# Altium project Peggy Receiver.PrjPcb
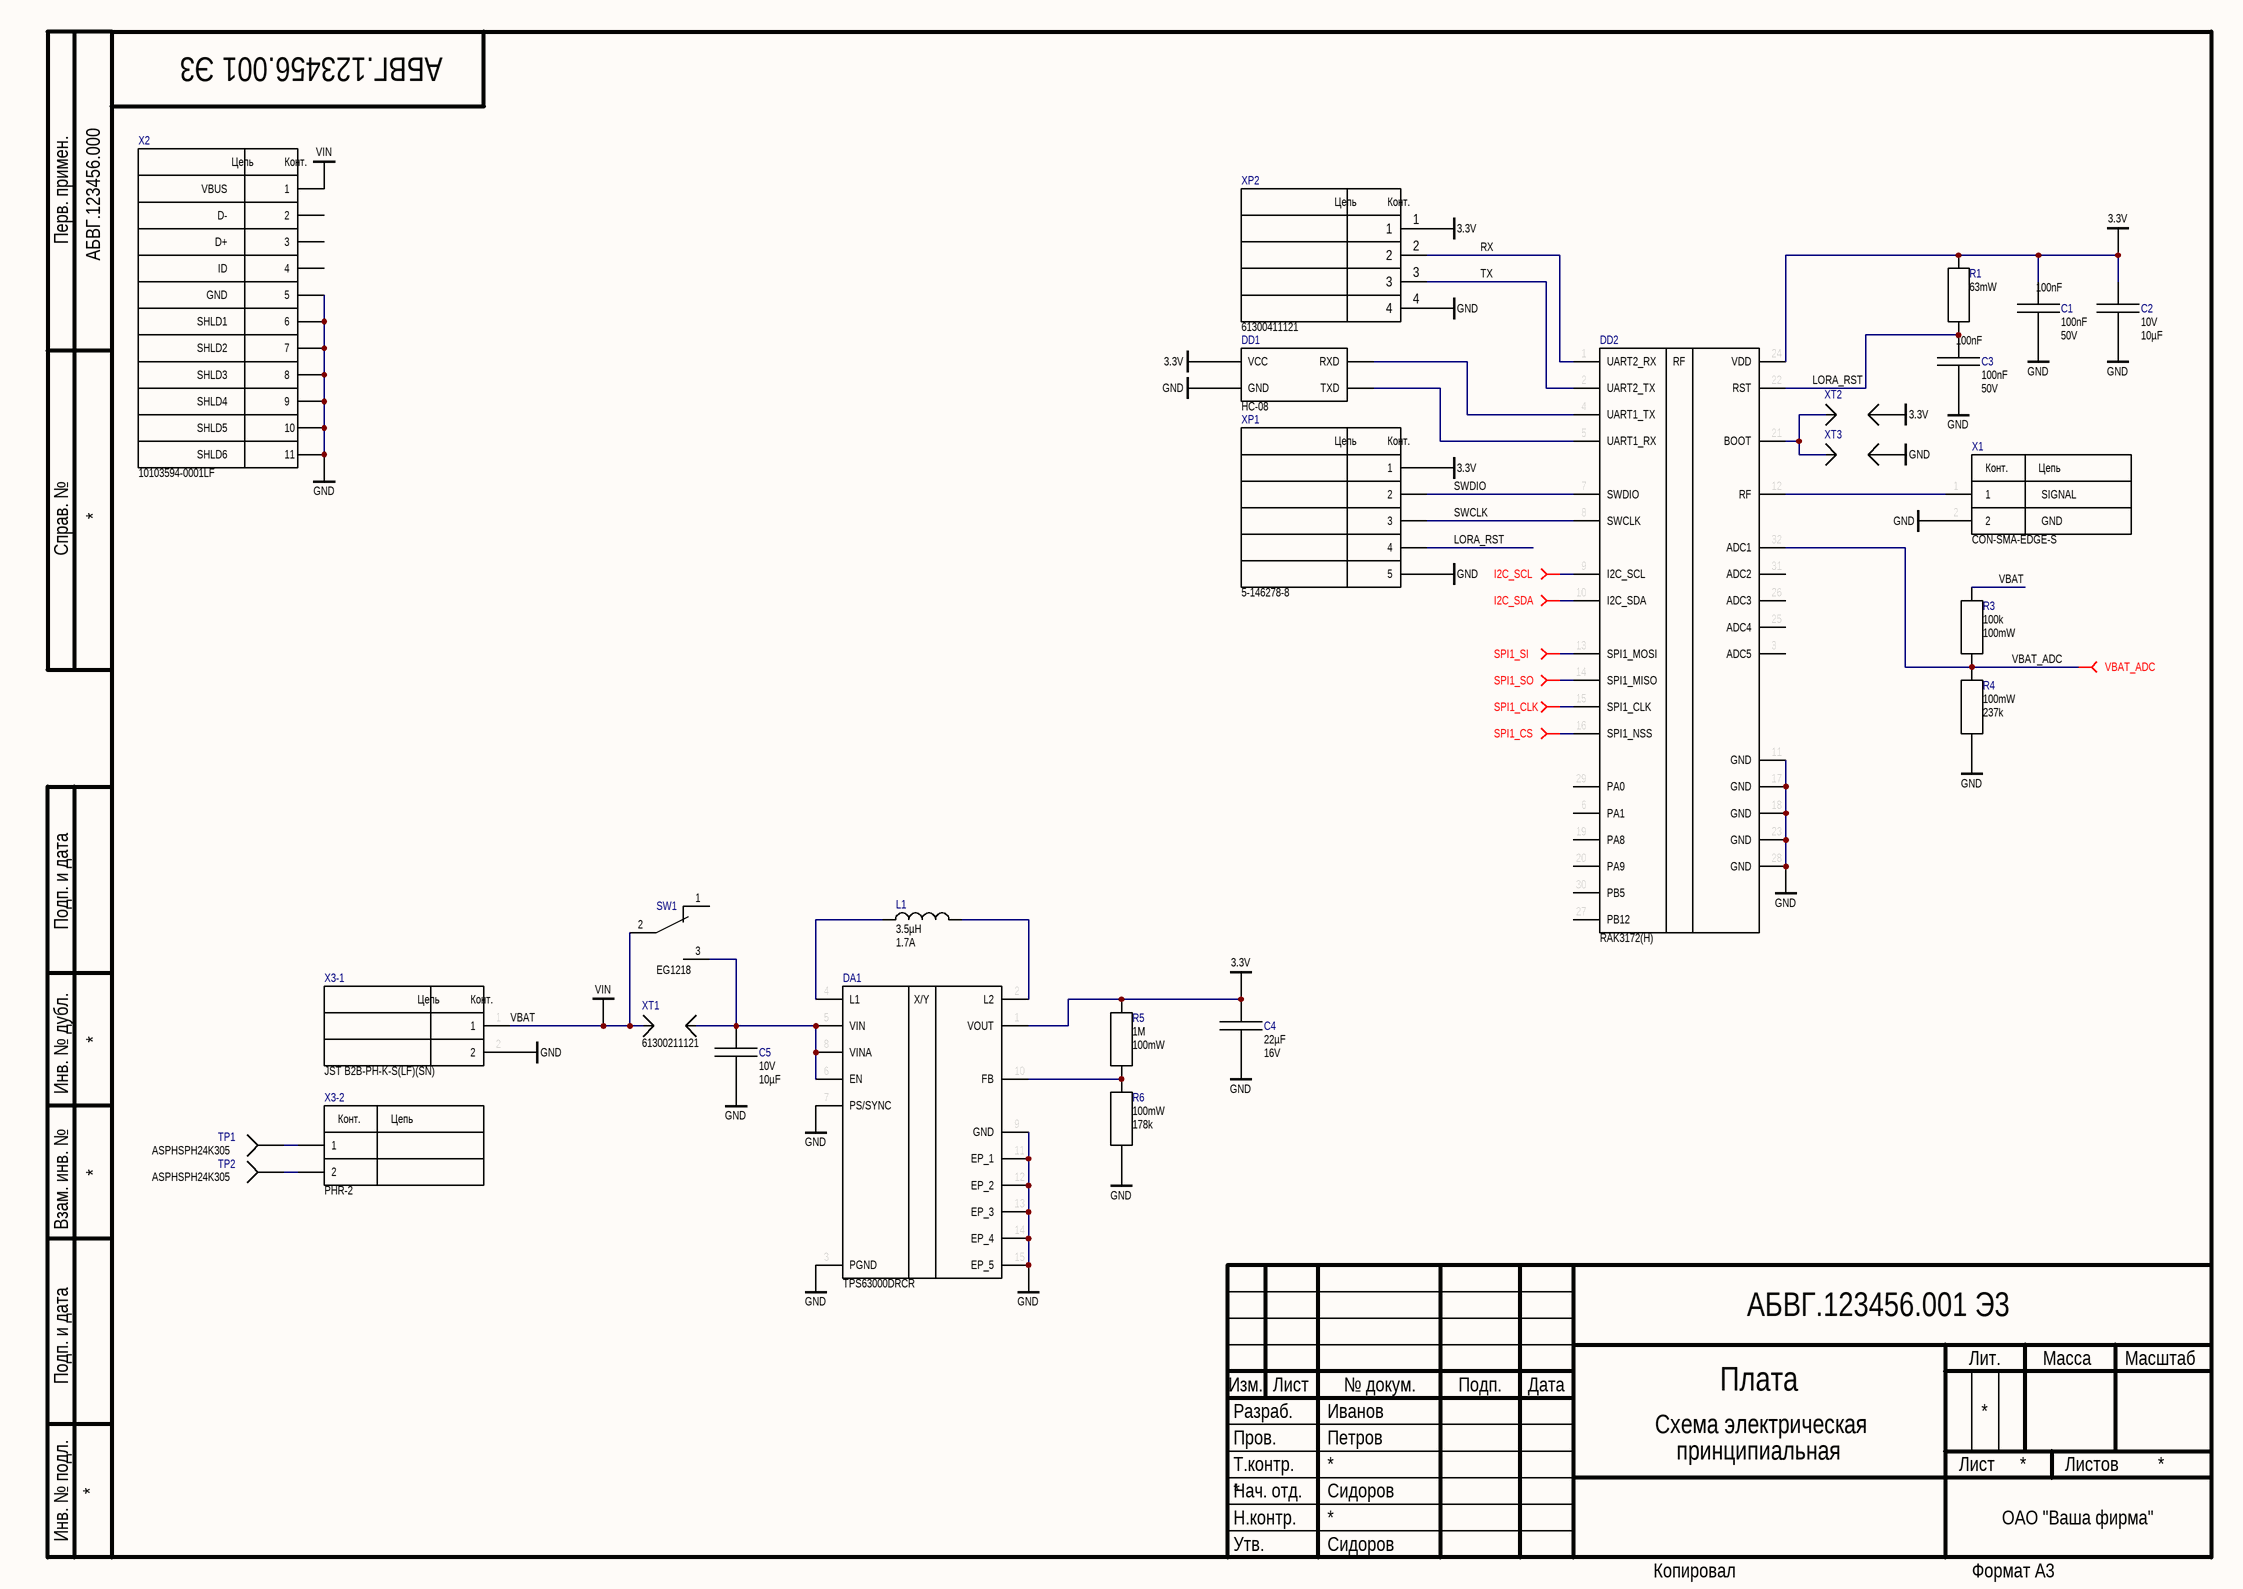
[diagram p0: Принципиальная схема Peggy Receiver.SchDoc]
CAGE_CODE: ?????; CONTRACT_NUMBER: <CONTRACT NO>; DOC_NO_ASSY_DWG: <ASSY DWG NO>; DOC_NO_BOM: <BOM DOC NO>; DOC_NO_FAB_DWG: <FAB DWG NO>; DOC_NO_SCH_DWG: <SCH DWG NO>; PCB_2_DEC_TOL: +/-.01; PCB_3_DEC_TOL: +/-.010; PCB_ANG_TOL: +/-1/2; PCB_ASSEMBLY_NO: <PCB ASSY NO>; PCB_CHECKER: - -----; PCB_CHECKER_APP_DATE: --/--/----; PCB_DESIGNER: - -----; PCB_DESIGNER_APP_DATE: --/--/----; PCB_DWG_NO: <PCB DWG NO>; PCB_ENGINEER: - -----; PCB_ENGINEER_APP_DATE: --/--/----; PCB_PART_NUMBER: <PCB PN>; PCB_REV: A; SCH_REV: A
1 sheet, 33 parts. Net scope: global (net labels, ports and power ports of the same name join across sheets).
Board file: Peggy Receiver.PcbDoc

## Sheet Принципиальная схема Peggy Receiver.SchDoc
size 420 x 297 mm; ENG_APP_DATE: --/--/--; DSN_APP_DATE: --/--/--; CHK_APP_DATE: --/--/--; Scale: 1:1; Разраб.: Иванов; Обозначение документа: АБВГ.123456.001 Э3; Пров.: Петров; Утв.: Сидоров; Наименование организации: ОАО "Ваша фирма"; Перв. применение: АБВГ.123456.000; Наименование изделия 1: Плата; Наименование изделия 2: Схема электрическая; Наименование изделия 3: принципиальная; Нач. отд.: Нач. отд.; Фамилия нач. отд.: Сидоров

### Parts
C1  value 100nF  Voltage Rating: 50V  [CAPC1608X09M]  (hidden comment: GCM188R71H104KA57D)
C2  value 10µF  Voltage Rating: 10V  [CAPC1608X87X35ML15T15]  (hidden comment: C0603C106M8PAC7867)
C3  value 100nF  Voltage Rating: 50V  [CAPC1608X09M]  (hidden comment: GCM188R71H104KA57D)
C4  value 22µF  Voltage Rating: 16V  [CAPC2013X140X45ML15T25]  (hidden comment: C2012X5R1C226K125AC)
C5  value 10µF  Voltage Rating: 10V  [CAPC1608X87X35ML15T15]  (hidden comment: C0603C106M8PAC7867)
DA1  Manufacturer Part Number: TPS63000DRCR  [TPS63002DRCR]  (hidden comment: TPS63000IDRCRQ1)
DD1  HC-08  [HC-08]
DD2  RAK3172(H)  [RAK3172(H)-Footprint-1]
I2C_SCL  TP_1MM  [New footprint 1]  (value not drawn)  (no BOM)
I2C_SDA  TP_1MM  [New footprint 1]  (value not drawn)  (no BOM)
L1  value 3.5µH  Saturation Current: 1.7A  [SRU5018680Y]  (hidden comment: SRU5018-3R5Y)
R1  Power Rating: 63mW  [RESC1608X55X25ML10T15]  (hidden comment: RNCF0603BTE10K0)
R3  Resistance: 100k  Power Rating: 100mW  [RESC1608X55X25ML10T15]  (hidden comment: RMCF0603FT100K)
R4  Power Rating: 100mW  Resistance: 237k  [RESC1608X55X25ML10T15]  (hidden comment: ERJ-3EKF2373V)
R5  value 1M  Power Rating: 100mW  [RESC1608X95X40ML15T20]  (hidden comment: RMCF0603JT1M00)
R6  value 178k  Power Rating: 100mW  [RESC1608X95X40ML15T20]  (hidden comment: ERJ-3EKF1783V)
SPI1_CLK  TP_1MM  [New footprint 1]  (value not drawn)  (no BOM)
SPI1_CS  TP_1MM  [New footprint 1]  (value not drawn)  (no BOM)
SPI1_SI  TP_1MM  [New footprint 1]  (value not drawn)  (no BOM)
SPI1_SO  TP_1MM  [New footprint 1]  (value not drawn)  (no BOM)
SW1  EG1218  [ESWI-EG1218_V]
TP1  ASPHSPH24K305  (mechanical)
TP2  ASPHSPH24K305  (mechanical)
VBAT_ADC  TP_1MM  [New footprint 1]  (value not drawn)  (no BOM)
X1  CON-SMA-EDGE-S  [RFSOLUTIONS_CON-SMA-EDGE-S]
X2  10103594-0001LF  [FCI-10103594-0001LF_V]
X3-1  Manufacturer Part Number: JST B2B-PH-K-S(LF)(SN)  [JST-S2B-PH-K-S_V]  (hidden comment: B2B-PH-K-S)
X3-2  PHR-2
XP1  Manufacturer Part Number: 5-146278-8  [5-146278-8-Footprint-1]  (hidden comment: 5-146278-5)
XP2  61300411121  [20021311-00010T4LF-Footprint-1]
XT1  Manufacturer Part Number: 61300211121  [CON%3A PLS-2]  (hidden comment: Jumper_1x2)
XT2  Jumper_solderable  [JUMPER-Footprint-2]  (value not drawn)
XT3  Jumper_solderable  [JUMPER-Footprint-2]  (value not drawn)

### Nets
3.3V: C1.2 C2.2 C4.2 DA1.1(VOUT) DD1.1(VCC) DD2.24(VDD) R1.1 R5.2 XP1.1 XP2.1 XT2.2
GND: C1.1 C2.1 C3.1 C4.1 C5.1 DA1.3(PGND) DA1.7(PS/SYNC) DA1.9(GND) DA1.11(EP_1) DA1.12(EP_2) DA1.13(EP_3) DA1.14(EP_4) DA1.15(EP_5) DD1.2(GND) DD2.11(GND) DD2.17(GND) DD2.18(GND) DD2.23(GND) DD2.28(GND) R4.1 R6.1 X1.2(GND) X2.5(GND) X2.6(SHLD1) X2.7(SHLD2) X2.8(SHLD3) X2.9(SHLD4) X2.10(SHLD5) X2.11(SHLD6) X3-1.2 XP1.5 XP2.4 XT3.2
VBAT: R3.2 SW1.2(COM) X2.1(VBUS) X3-1.1 XT1.1  [also labelled VIN]
LORA_RST: C3.2 DD2.22(RST) R1.2 XP1.4
RX: DD2.1(UART2_RX) XP2.2
SWCLK: DD2.8(SWCLK) XP1.3
SWDIO: DD2.7(SWDIO) XP1.2
TX: DD2.2(UART2_TX) XP2.3
VBAT_ADC: DD2.32(ADC1) R3.1 R4.2 VBAT_ADC.1
NetC5_2: C5.2 DA1.5(VIN) DA1.6(EN) DA1.8(VINA) SW1.3 XT1.2
NetDA1_2: DA1.2(L2) L1.2
NetDA1_4: DA1.4(L1) L1.1
NetDA1_10: DA1.10(FB) R5.1 R6.2
NetDD1_3: DD1.3(TXD) DD2.5(UART1_RX)
NetDD1_4: DD1.4(RXD) DD2.4(UART1_TX)
NetDD2_9: DD2.9(I2C_SCL) I2C_SCL.1
NetDD2_10: DD2.10(I2C_SDA) I2C_SDA.1
NetDD2_12: DD2.12(RF) X1.1(SIGNAL)
NetDD2_13: DD2.13(SPI1_MOSI) SPI1_SI.1
NetDD2_14: DD2.14(SPI1_MISO) SPI1_SO.1
NetDD2_15: DD2.15(SPI1_CLK) SPI1_CLK.1
NetDD2_16: DD2.16(SPI1_NSS) SPI1_CS.1
NetDD2_21: DD2.21(BOOT) XT2.1 XT3.1
NetTP1_1: TP1.1 X3-2.1
NetTP2_1: TP2.1 X3-2.2

Not connected (* = marked no-connect by the designer): DD2 3(ADC5) 6(PA1) 19(PA8) 20(PA9) 25(ADC4) 26(ADC3) 27(PB12) 29(PA0) 30(PB5) 31(ADC2); SW1 1; X2 2(D-) 3(D+) 4(ID)

### Notes on the sheet
- Перв. примен.
- Справ. №
- Подп. и дата
- Инв. № дубл.
- Взам. инв. №
- Разраб.
- Изм.
- Лист
- № докум.
- Подп.
- Дата
- Лит.
- Масса
- Масштаб
- Пров.
- Т.контр.
- Листов
- Инв. № подл.
- Утв.
- Н.контр.
- Копировал
- Формат А3
- (in symbol CMP-002-00038-6) Цепь; Конт.
- (in symbol CMP-002-00086-2) Конт.; Цепь
- (in symbol CMP-002-00092-4) Цепь; Конт.
- (in symbol CMP-002-00125-1) Цепь; Конт.
- (in symbol CMP-002-00126-1) Конт.; Цепь
- (in symbol CMP-002-00131-1) Цепь; Конт.
- (in symbol CMP-031-00015-5) X/Y

### Library data of the parts
C1 C3 = CMP-001-00128-7: CAP CER 0.1UF 50V X7R 0603; Manufacturer: Murata; Tolerance: 10%; Approvals: CSA,UR; Color: Grey; RoHS Compliant: Yes; Case/Package: 0603; Max Operating Temperature: 125°C; Min Operating Temperature: -55°C; Case Code (Metric): 1608; Depth: 0.8mm; Dielectric: X7R; Height: 0.8mm; Length: 1.6mm; Mount: Surface Mount; Package Quantity: 1; Packaging: Tape and Reel; Radiation Hardening: No; Series: GCM; Termination: SMD/SMT; Thickness: 0.035inch; Width: 0.031inch; Manufacturer Part Number: GCM188R71H104KA57D; Lead Free: Lead Free; REACH SVHC: No SVHC; Voltage: 50V; ComponentLink1Description: https://datasheet.ciiva.com/16624/product-16624562.pdf?src-supplier=Avnet+Europe; ComponentLink1URL: https://datasheet.ciiva.com/16624/product-16624562.pdf?src-supplier=Avnet+Europe; ComponentLink2Description: https://datasheet.ciiva.com/133/product-133574.pdf?src-supplier=Digi-Key; ComponentLink2URL: https://datasheet.ciiva.com/133/product-133574.pdf?src-supplier=Digi-Key; ComponentLink3Description: https://datasheet.ciiva.com/133/product-133575.pdf?src-supplier=Digi-Key; ComponentLink3URL: https://datasheet.ciiva.com/133/product-133575.pdf?src-supplier=Digi-Key; ComponentLink4Description: https://datasheet.ciiva.com/18183/getdatasheetpartid-98693-18183626.pdf?src-supplier=Verical; ComponentLink4URL: https://datasheet.ciiva.com/18183/getdatasheetpartid-98693-18183626.pdf?src-supplier=Verical; ComponentLink5Description: https://datasheet.ciiva.com/11786/0900766b80ef92d0-11786863.pdf?src-supplier=RSComponents; ComponentLink5URL: https://datasheet.ciiva.com/11786/0900766b80ef92d0-11786863.pdf?src-supplier=RSComponents; ComponentLink6Description: https://datasheet.ciiva.com/133/product-133573.pdf?src-supplier=Digi-Key; ComponentLink6URL: https://datasheet.ciiva.com/133/product-133573.pdf?src-supplier=Digi-Key; ComponentLink7Description: https://datasheet.ciiva.com/2989/product-2989242.pdf?src-supplier=Avnet; ComponentLink7URL: https://datasheet.ciiva.com/2989/product-2989242.pdf?src-supplier=Avnet; ComponentLink8Description: https://datasheet.ciiva.com/16497/product-16497247.pdf?src-supplier=Future+Electronics; ComponentLink8URL: https://datasheet.ciiva.com/16497/product-16497247.pdf?src-supplier=Future+Electronics; Construction: Flat; Design Item ID: 1_16; Pricing 1: 1=0,11000, 10=0,07900, 50=0,04280, 100=0,03500, 500=0,02502, 1000=0,01966 (USD); Ratings: AEC-Q200; RoHS: Yes; Source: Meteo_1.SCHLIB; Stock 1: 4755830; Voltage Rating (DC): 50V; Capacitance: 100nF
C2 C5 = CMP-009-00284-3: Cap Ceramic 10uF 10V X5R 20% SMD 0603 85°C Paper T/R; Manufacturer: KEMET; Mounting Technology: SMT; Tolerance: 20%; Pins: 2; RoHS Compliant: Yes; Case/Package: 0603; Min Operating Temperature: -55°C; Max Operating Temperature: 85°C; Mount: Surface Mount; Case Code (Imperial): 0603; Packaging: Cut Tape; Case Code (Metric): 1608; Capacitance: 10µF; Manufacturer Part Number: C0603C106M8PAC7867
C4 = CMP-001-00144-2: TDK - C2012X5R1C226K125AC - SMD Multilayer Ceramic Capacitor, 22 µF, 16 V, 0805 [2012 Metric], ± 10%, X5R, C Series; Case/Package: 0805; RoHS Compliant: Yes; Min Operating Temperature: -55°C; Tolerance: 10%; Max Operating Temperature: 85°C; Manufacturer Part Number: C2012X5R1C226K125AC; Series: C; Thickness: 0.057inch; Manufacturer: TDK; Case Code (Imperial): 0805; Mount: Surface Mount; Case Code (Metric): 2012; Termination: Wraparound; Packaging: Tape and Reel; Capacitance: 22µF; Width: 0.049inch; Length: 2mm; Dielectric: X5R; Construction: Flat; Depth: 1.25mm; Package Quantity: 1; Dielectric Material: Ceramic; Height: 1.25mm; Lead Free: Lead Free; Number of Pins: 2; REACH SVHC: No SVHC; Resistor Type: Ceramic; Voltage: 16V; Voltage Rating (DC): 16V; Weight: 0.000194oz
DA1 = CMP-031-00015-5: IC REG BUCK BOOST ADJ 1.6A 10SON; Manufacturer: Texas Instruments; Max Input Voltage: 5.5V; Topology: Buck-Boost; Min Output Voltage: 1.2V; Quiescent Current: 40uA; Output Type: Adjustable; Number of Outputs: 1; Synchronous Rectifier: Yes; Max Output Current: 1.2A; Min Input Voltage: 1.8V; Output Configuration: Positive; Efficiency: 96%; Switching Frequency: 1.5MHz; Min Operating Temperature: -40°C; Output Current: 1.6A; Max Output Voltage: 5.5V; Output Voltage: 5.5V; Weight: 0.000921oz; Series: Automotive, AEC-Q100; Max Operating Temperature: 85°C; Contact Plating: Gold; Number of Pins: 10; Width: 3mm; Operating Supply Voltage: 5.5V; Packaging: Tape and Reel; RoHS Compliant: Yes; Package Quantity: 1; Lead Free: Lead Free; Case/Package: VSON
DD1 = CMP-00025-00009-1: Bluetooth 4.0 Module; Manufacturer: HC-08; Manufacturer Part Number: HC-08
DD2 = CMP-00025-00003-1: RAK3172 WisDuo LPWAN Module; Manufacturer: RAK Wireless; Manufacturer Part Number: RAK3172(H)
I2C_SCL I2C_SDA SPI1_CLK SPI1_CS SPI1_SI SPI1_SO VBAT_ADC = CMP-002-00080-5: Test Point, 1mm diam; Manufacturer: SRG_DEV; Pins: 1; Manufacturer Part Number: TP_1MM
L1 = CMP-006-00039-3: Ind Power Shielded Wirewound 3.5uH 30% 100KHz 9Q-Factor Ferrite 2.1A T/R; Manufacturer: Bourns; Self Resonant Frequency: 90MHz; Q Factor: 9; DC Resistance (DCR): 32mR; DC Current: 2.1A; Height: 1.8mm; Packaging: Tape and Reel; Tolerance: 30%; Series: SRU5018; Core Material: Ferrite; Inductance: 3.5uH; Current Rating: 2.1A; Length: 5.2mm; Termination: SMD/SMT; Test Frequency: 100kHz; Shielding: Shielded; Number of Pins: 2; RoHS Compliant: Yes; Case/Package: 5018; Max DC Current: 2.1A; Military Standard: Not; Min Operating Temperature: -40°C; Mount: Surface Mount; Width: 0.205inch; Package Quantity: 1000; Max Operating Temperature: 125°C; Depth: 5.4mm; Manufacturer Part Number: SRU5018-3R5Y
R1 = CMP-009-00270-3: RES 10K OHM 0.1% 1/16W 0603; Max Power Dissipation: 100mW; Voltage Rating: 75V; Component Comment: 10k 63mW; Temperature Coefficient: 25ppm/°C; Radiation Hardening: No; Length: 0.063inch; Series: RNCF; Resistor Type: Thin Film; Lead Free: Lead Free; Resistance: 10k; Packaging: Tape and Reel; Max Operating Temperature: 155°C; Case Code (Metric): 1608; Contact Plating: Tin,Matte; Width: 0.031inch; Size Code: 0603; RoHS Compliant: Yes; Height: 0.022inch; Number of Terminations: 2; Package Quantity: 5000; Tolerance: 0.1%; Pins: 2; Mount: Surface Mount; Min Operating Temperature: -55°C; Case/Package: 0603; Case Code (Imperial): 0603; Features: Moisture Resistant
R3 = CMP-009-00253-1: RES 100K OHM 1% 1/10W 0603; Manufacturer: Stackpole Electronics Inc; Component Comment: 100k 100mW; Temperature Coefficient: 100ppm/°C; Working Voltage: 75V; Packaging: Tape and Reel; Height: 0.022inch; Features: Automotive AEC-Q200; RoHS Compliant: Yes; Case/Package: 0603; Contact Plating: Tin,Matte; Series: RMCF; Manufacturer Part Number: RMCF0603FT100K; Max Operating Temperature: 155°C; Max Power Dissipation: 100mW; Depth: 0.8mm; Radiation Hardening: No; Min Operating Temperature: -55°C; Military Standard: Not; Tolerance: 1%; Mount: Surface Mount; Construction: Rectangular; Case Code (Imperial): 0603; Width: 0.031inch; Number of Terminations: 2; Resistor Type: Thick Film; Lead Free: Lead Free; Case Code (Metric): 1608; Length: 1.55mm
R4 = CMP-009-00311-2: RES SMD 237K OHM 1% 1/10W 0603; Manufacturer: Panasonic; Voltage Rating: 75V; Voltage Rating (DC): 50V; Component Comment: 237k 100mW; Temperature Coefficient: 100ppm/°C; Min Operating Temperature: -55°C; Features: Automotive AEC-Q200; Width: 0.8mm; RoHS Compliant: Yes; Package Quantity: 1; Construction: Rectangular; Height: 0.45mm; Length: 1.6mm; Termination: SMD/SMT; Depth: 0.8mm; Packaging: Tape and Reel; Resistance Tolerance: 1%; Number of Terminations: 2; Military Standard: Not; Case Code (Imperial): 0603; Mount: Surface Mount; Tolerance: 1%; Case Code (Metric): 1608; Case/Package: 0603; Series: ERJ; Max Operating Temperature: 155°C; Contact Plating: Tin; Technology: THICK FILM; REACH SVHC: Yes; Max Power Dissipation: 100mW; Radiation Hardening: No; Resistor Type: Thick Film; Manufacturer Part Number: ERJ-3EKF2373V
R5 = CMP-00024-2: RES 1M OHM 5% 1/10W 0603; Manufacturer: Stackpole Electronics; Working Voltage: 75V; Component Comment: 1M 100mW; Temperature Coefficient: 200ppm/°C; Radiation Hardening: No; Width: 0.031inch; Tolerance: 5%; Case Code (Metric): 1608; Mount: Surface Mount; Number of Terminations: 2; Construction: Rectangular; Military Standard: Not; Resistor Type: Thick Film; Height: 0.022inch; Max Power Dissipation: 100mW; Series: RMCF; Contact Plating: Tin,Matte; Case Code (Imperial): 0603; Max Operating Temperature: 155°C; Resistance: 1M; Depth: 0.8mm; Lead Free: Lead Free; Min Operating Temperature: -55°C; Length: 1.55mm; Technology: THICK FILM; Case/Package: 0603; Features: Automotive AEC-Q200; Packaging: Tape and Reel; RoHS Compliant: Yes; Manufacturer Part Number: RMCF0603JT1M00
R6 = CMP-00025-2: ICK FILM, RESISTOR, 178KOHM, 100mW, ±1%; Product Range:PANASONIC - ERJ Series; Resistance:178kohm; Power Rating:100mW; Resistance Tolerance:± 1%; Resistor Case Style:0603 ^1608 Metric]; Resistor Element Type:Thick Film; MSL:-; Voltage Rating (DC): 50V; Component Comment: 178k 100mW; Temperature Coefficient: 100ppm/°C; Voltage Rating: 75V; Resistance: 178k; Depth: 0.8mm; Width: 0.8mm; Construction: Rectangular; Lead Free: Lead Free; REACH SVHC: No SVHC; Termination: SMD/SMT; Series: ERJ; Number of Terminations: 2; Case Code (Metric): 1608; Technology: THICK FILM; Resistance Tolerance: 1%; Military Standard: Not; Min Operating Temperature: -55°C; Max Operating Temperature: 155°C; Case/Package: 0603; Features: Automotive AEC-Q200; Length: 1.6mm; Package Quantity: 1; Case Code (Imperial): 0603; Tolerance: 1%; Packaging: Tape and Reel; Resistor Type: Thick Film; Max Power Dissipation: 100mW; Contact Plating: Tin; Mount: Surface Mount; Height: 0.45mm; RoHS Compliant: Yes; Manufacturer Part Number: ERJ-3EKF1783V; Manufacturer: Panasonic
SW1 = CMP-011-00006-2: Slide Switch, SPDT, 500 V, -20 to 70 degC, 3-Pin THD, RoHS, Bulk; Manufacturer: E-Switch; Operating Force: 250gf; Voltage Rating (DC): 30V; Current Rating: 200mA; Case/Package: EG1218; Throw Configuration: SPDT; Voltage Rating (AC): 30V; Datasheet URL: https://www.e-switch.com/system/asset/product_line/data_sheet/119/EG.pdf; Package Reference: EG1218; Contact Current Rating: 200mA; RoHS Compliant: True; Packaging: Bulk; Package Quantity: 1000; Manufacturer URL: http://www.e-switch.ch/en/; Datasheet Version: Oct-15; Package Description: 3-Pin Through Hole Device, Body 11.6 x 4 mm, Pitch 2.5 mm; Min Operating Temperature: -20°C; Pins: 3; Contact Finish: Silver; Contact Plating: Silver; Max Operating Temperature: 70°C; Contact Material: Copper; Mounting Technology: TH; Manufacturer Part Number: EG1218
TP1 TP2 = CMP-002-00128-2: Black 24 AWG Jumper Lead Socket to Socket Tin 12.0; Manufacturer: JST Sales America Inc.; Number of Conductors: 1; Wire/Cable Gauge: 24AWG; Length: 12inch; Color: Black; Manufacturer Part Number: ASPHSPH24K305; Package Quantity: 1000; Contact Plating: Tin; Number of Rows: 1
X1 = CMP-002-00086-2: CONN SMA JACK STR EDGE MNT; Manufacturer: RF Solutions; Connector Type: SMA,Socket; Number of Ports: 1; Termination: Solder; Pins: 3; Package Quantity: 1; Mount: Edge; Case/Package: SMA; Manufacturer Part Number: CON-SMA-EDGE-S; Fastening Type: Threaded
X2 = CMP-002-00038-6: Micro USB 2.0 B Receptacle, 5 Position, Height 3.24 mm, -55 to 85 degC, RoHS, Tape and Reel; Manufacturer: Amphenol ICC (FCI); Voltage Rating: 100V; Gender: Female; Current Rating: 1.8A; Max Operating Temperature: 85°C; Pins: 5; Datasheet URL: http://portal.fciconnect.com/Comergent//fci/drawing/10103594.pdf; Package Quantity: 1500; Datasheet Version: Rev. A, 06/2010; Min Operating Temperature: -55°C; Package Reference: FCI-10103594-0001LF; Package Description: 5-Pin Surface Mount Device, Body 8.04 x 5.62 mm; Case/Package: FCI-10103594-0001LF; Manufacturer URL: http://portal.fciconnect.com/; Lead Pitch: 0.65mm; RoHS Compliant: True; Contact Plating: Gold; Contact Material: Copper; Manufacturer Part Number: 10103594-0001LF; Packaging: TapeandReel; Mounting Technology: SM; Connector Type: USB
X3-1 = CMP-002-00125-1: CONN HEADER VERT 2POS 2MM; Manufacturer: Japan Solderless Terminals; Gender: Male; Connector Type: Header; Height: 0.35inch; Max Operating Temperature: 85°C; Pins: 2; Min Operating Temperature: -25°C; RoHS Compliant: Unknown; Case/Package: S2B-PH-K-S; Length: 0.2inch; Width: 0.24inch; Mounting Technology: SM; Weight: 0.0625lb
X3-2 = CMP-002-00126-1: CONN HOUSING PH 2POS 2MM WHITE; Manufacturer: JST; Connector Type: Receptacle; Insulation Resistance: 1GR; Number of Positions: 2; Wire Gauge (Max): 30AWG; Current Rating: 2A; Working Voltage: 100V; Gender: Female; Wire Gauge (Min): 24AWG; Contact Resistance: 10mR; Orientation: Straight; Weight: 0.0625lb; Flammability Rating: UL94 V-0; Pins: 2; Depth: 6.85mm; Color: Natural,White; Contact Material: Bronze,Tin; Pitch: 2mm; Fastening Type: Detent; Packaging: Bulk; Series: PH; Manufacturer Part Number: PHR-2; Contact Plating: Tin; Lead Free: Lead Free; REACH SVHC: No SVHC; Termination: Crimp; Mount: Free Hanging,Cable; Number of Rows: 1; Length: 5.8mm; Min Operating Temperature: -25°C; Number of Contacts: 2; Max Current Rating: 2A; Housing Material: Polyamide; Housing Color: White; Material: Nylon; Contact Type: Female Socket; Max Voltage Rating (AC): 100V; Width: 4.5mm; Max Operating Temperature: 85°C; Number of Pins: 2; Height: 6.4mm
XP1 = CMP-002-00131-1: Conn Unshrouded Header HDR 5 POS 2.54mm Solder ST Thru-Hole Carton; Manufacturer: TE Connectivity; Mating Connector Lock: No (Without); PCB Mounting Orientation: Vertical; Board Standoff: Yes (With); Connector Type: Plug,Header,Pin; PCB Mount Retention: Without; Keyed: No; PCB Thickness: 0.062inch; High Temperature Housing: Yes; Number of Positions: 5; Contact Post Length: 0.12inch; Approvals: CSA; Gender: Male; Contact Current Rating: 3A; Radiation Hardening: No; Gasket: No (Without); Contact Protection: No (Without); Contact Gender: Male; Housing Material: Polymer; Termination: Through Hole; Series: AMPMODU MOD II; Selectively Loaded: No (Without); Row Spacing: 2.54mm; Flammability Rating: UL94 V-0; Orientation: Straight; Mount: Through Hole; Number of Rows: 1; Stabilizers: No (Without); Min Operating Temperature: -65°C; Depth: 2.34mm; ELV: Compliant; Max Operating Temperature: 105°C; Package Quantity: 480; High Speed Serial Data Connector: No; RoHS Compliant: Yes; Packaging: Carton; Length: 12.29mm; Contact Mating Length: 0.23inch; Contact Shape: Square; Number of Contacts: 5; Pins: 5; Color: Black; Strain Relief: No (Without); Pitch: 2.54mm; Contact Plating: Tin; Lead Free: Lead Free; Mating Alignment: No (Without); Contact Type: Male Pin; Contact Material: Bronze; Housing Color: Black
XP2 = CMP-002-00092-4: Conn Unshrouded Header HDR 4 POS 2.54mm Solder ST Thru-Hole Bag; Manufacturer: Würth Elektronik; Position: 4; Connector Type: Male Pin; Gender: Male; Pitch: 0.1inch; Number of Rows: 1; Number of Positions: 4; Contact Mating Length: 0.236inch; Color: Black; Contact Material: Copper; Lead Free: Lead Free; RoHS Compliant: Yes; Packaging: Bulk; Mount: Through Hole; Number of Contacts: 4; REACH SVHC: Unknown; Contact Plating: Gold; Termination: Solder; Pins: 4; Manufacturer Part Number: 61300411121
XT1 = CMP-002-00088-9: WURTH ELEKTRONIK - 61300211121 - Pin Header, Vertical, Board-to-Board, 2.54 mm, 1 Rows, 2 Contacts, Through Hole Straight; Manufacturer: Wurth Electronics; Voltage Rating: 250V; Gender: Male; Current Rating: 3A; Number of Contacts: 2; Connector Type: Male Pin; Pitch: 0.1inch; Series: WR-PHD; Termination: Through Hole; Packaging: Bulk; Contact Gender: Male; Color: Black; Mount: Through Hole; Contact Plating: Gold; Number of Rows: 1; Contact Type: Male Pin; Housing Material: PBT; Min Operating Temperature: -40°C; Supplier 1: Digi-Key; Contact Material: Copper Alloy,Copper; Pins: 2; Max Operating Temperature: 125°C; Number of Positions: 2; REACH SVHC: Unknown; Lead Free: Lead Free; Supplier Part Number 1: 732-5315-ND; Contact Mating Length: 0.236inch
XT2 XT3 = CMP-002-00130-2: Solderable Jumper; Manufacturer Part Number: Home made; Connector Type: Male Pin; Gender: Male; Pins: 2; Min Operating Temperature: -40°C; Manufacturer: Home made; Max Operating Temperature: 125°C

## Assembly variants
Variant of Peggy Receiver: not fitted XP1 XP2 XT2 XT3 XT?